# EAGLE design sliit 2019_V3 (EAGLE 9.5.0)

## Sheet 1 of 6
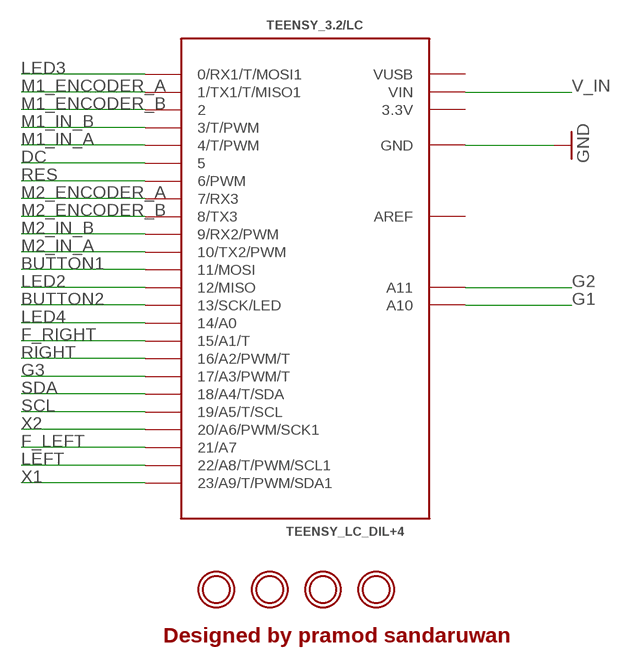
[diagram p0: schematic, sheet 1]

### Parts
TEENSY_3.2/LC  TEENSY_LC_DIL+4  [TEENSY3-DIL+4]
U$7  MOUNTINGHOLE2.5  [MOUNTINGHOLE_2.5_PLATED]
U$10  MOUNTINGHOLE2.5  [MOUNTINGHOLE_2.5_PLATED]
U$11  MOUNTINGHOLE2.5  [MOUNTINGHOLE_2.5_PLATED]
U$12  MOUNTINGHOLE2.5  [MOUNTINGHOLE_2.5_PLATED]

### Nets
BUTTON1: TEENSY_3.2/LC.11(11/MOSI) ; also sheet 5
BUTTON2: TEENSY_3.2/LC.13(13/SCK/LED) ; also sheet 5
DC: TEENSY_3.2/LC.5 ; also sheet 6
F_LEFT: TEENSY_3.2/LC.21/A7 ; also sheet 3
F_RIGHT: TEENSY_3.2/LC.15/A1(15/A1/T) ; also sheet 3
G1: TEENSY_3.2/LC.A10 ; also sheet 3
G2: TEENSY_3.2/LC.A11 ; also sheet 3
G3: TEENSY_3.2/LC.17/A3(17/A3/PWM/T) ; also sheet 3
GND: TEENSY_3.2/LC.AGND(GND) TEENSY_3.2/LC.GND ; also sheet 2,3,4,5,6
LED2: TEENSY_3.2/LC.12(12/MISO) ; also sheet 5
LED3: TEENSY_3.2/LC.0(0/RX1/T/MOSI1) ; also sheet 3,5
LED4: TEENSY_3.2/LC.14/A0 ; also sheet 5
LEFT: TEENSY_3.2/LC.22/A8(22/A8/T/PWM/SCL1) ; also sheet 3
M1_ENCODER_A: TEENSY_3.2/LC.1(1/TX1/T/MISO1) ; also sheet 4
M1_ENCODER_B: TEENSY_3.2/LC.2 ; also sheet 4
M1_IN_A: TEENSY_3.2/LC.4(4/T/PWM) ; also sheet 4
M1_IN_B: TEENSY_3.2/LC.3(3/T/PWM) ; also sheet 4
M2_ENCODER_A: TEENSY_3.2/LC.7(7/RX3) ; also sheet 4
M2_ENCODER_B: TEENSY_3.2/LC.8(8/TX3) ; also sheet 4
M2_IN_A: TEENSY_3.2/LC.10(10/TX2/PWM) ; also sheet 4
M2_IN_B: TEENSY_3.2/LC.9(9/RX2/PWM) ; also sheet 4
RES: TEENSY_3.2/LC.6(6/PWM) ; also sheet 6
RIGHT: TEENSY_3.2/LC.16/A2(16/A2/PWM/T) ; also sheet 3
SCL: TEENSY_3.2/LC.19/A5(19/A5/T/SCL) ; also sheet 3,6
SDA: TEENSY_3.2/LC.18/A4(18/A4/T/SDA) ; also sheet 3,6
V_IN: TEENSY_3.2/LC.VIN ; also sheet 2,4
X1: TEENSY_3.2/LC.23/A9(23/A9/T/PWM/SDA1) ; also sheet 3
X2: TEENSY_3.2/LC.20/A6(20/A6/PWM/SCK1) ; also sheet 3

### Notes on the sheet
- Designed by pramod sandaruwan

## Sheet 2 of 6: power
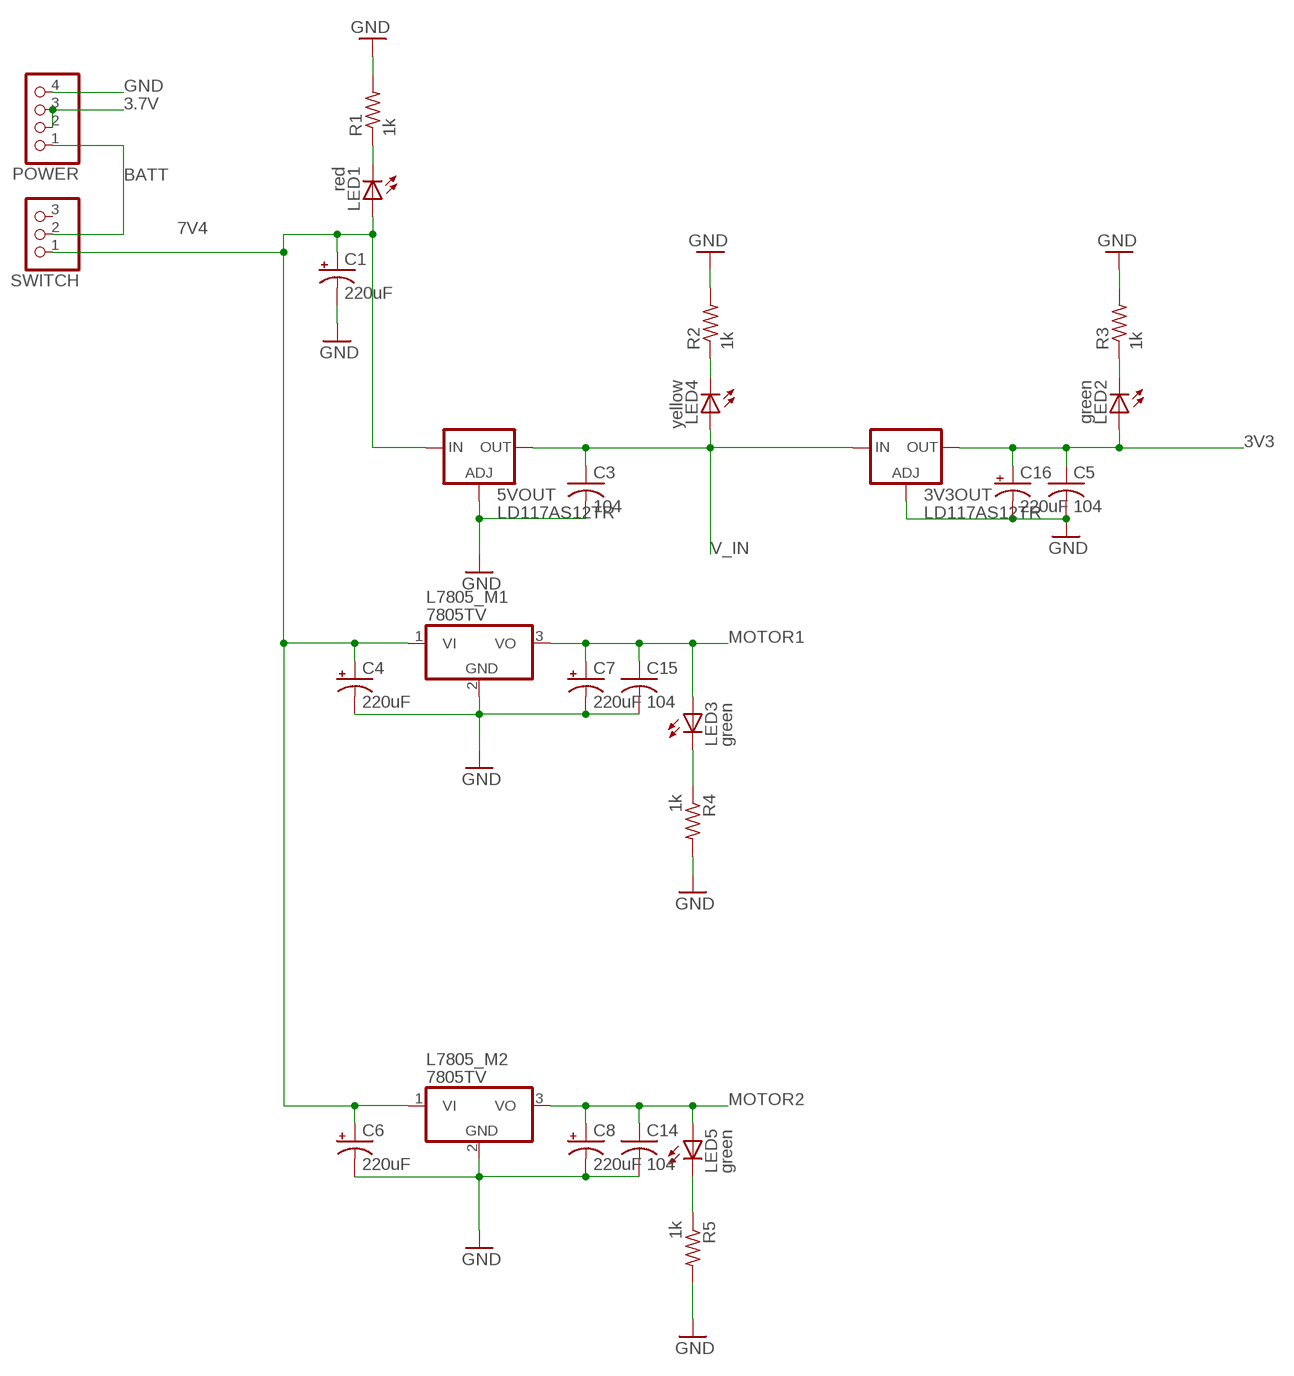
[diagram p1: schematic, sheet 2]

### Parts
3V3OUT  LD117AS12TR  [SOT223]
5VOUT  LD117AS12TR  [SOT223]
C1  220uF  CPOL-US153CLV-0505  [153CLV-0505]
C3  104  C-USC1206  [C1206]
C4  220uF  CPOL-US153CLV-0505  [153CLV-0505]
C5  104  C-USC1206  [C1206]
C6  220uF  CPOL-US153CLV-0505  [153CLV-0505]
C7  220uF  CPOL-US153CLV-0505  [153CLV-0505]
C8  220uF  CPOL-US153CLV-0505  [153CLV-0505]
C14  104  C-USC1206  [C1206]
C15  104  C-USC1206  [C1206]
C16  220uF  CPOL-US153CLV-0505  [153CLV-0505]
L7805_M1  7805TV  [TO220V]
L7805_M2  7805TV  [TO220V]
LED1  red  LEDSMT1206  [1206]
LED2  green  LEDSMT1206  [1206]
LED3  green  LEDSMT1206  [1206]
LED4  yellow  LEDSMT1206  [1206]
LED5  green  LEDSMT1206  [1206]
POWER  PINHD-1X4  [1X04]
R1  1k  R-US_R1206  [R1206]
R2  1k  R-US_R1206  [R1206]
R3  1k  R-US_R1206  [R1206]
R4  1k  R-US_R1206  [R1206]
R5  1k  R-US_R1206  [R1206]
SWITCH  PINHD-1X3  [1X03]

### Nets
3.7V: POWER.2 POWER.3
3V3: 3V3OUT.4(OUT) C5.1 C16.+ LED2.A ; also sheet 3,4,5,6
7V4: 5VOUT.3(IN) C1.+ C4.+ C6.+ L7805_M1.1(VI) L7805_M2.1(VI) LED1.A SWITCH.1
BATT: POWER.1 SWITCH.2
GND: 3V3OUT.1(ADJ) 5VOUT.1(ADJ) C1.- C3.2 C4.- C5.2 C6.- C7.- C8.- C14.2 C15.2 C16.- L7805_M1.2(GND) L7805_M2.2(GND) POWER.4 R1.2 R2.2 R3.2 R4.2 R5.2 ; also sheet 1,3,4,5,6
MOTOR1: C7.+ C15.1 L7805_M1.3(VO) LED3.A ; also sheet 4
MOTOR2: C8.+ C14.1 L7805_M2.3(VO) LED5.A ; also sheet 4
N$1: LED3.C R4.1
N$5: LED1.C R1.1
N$6: LED5.C R5.1
N$8: LED4.C R2.1
N$9: LED2.C R3.1
V_IN: 3V3OUT.3(IN) 5VOUT.4(OUT) C3.1 LED4.A ; also sheet 1,4
Unconnected: SWITCH.3

## Sheet 3 of 6: IR
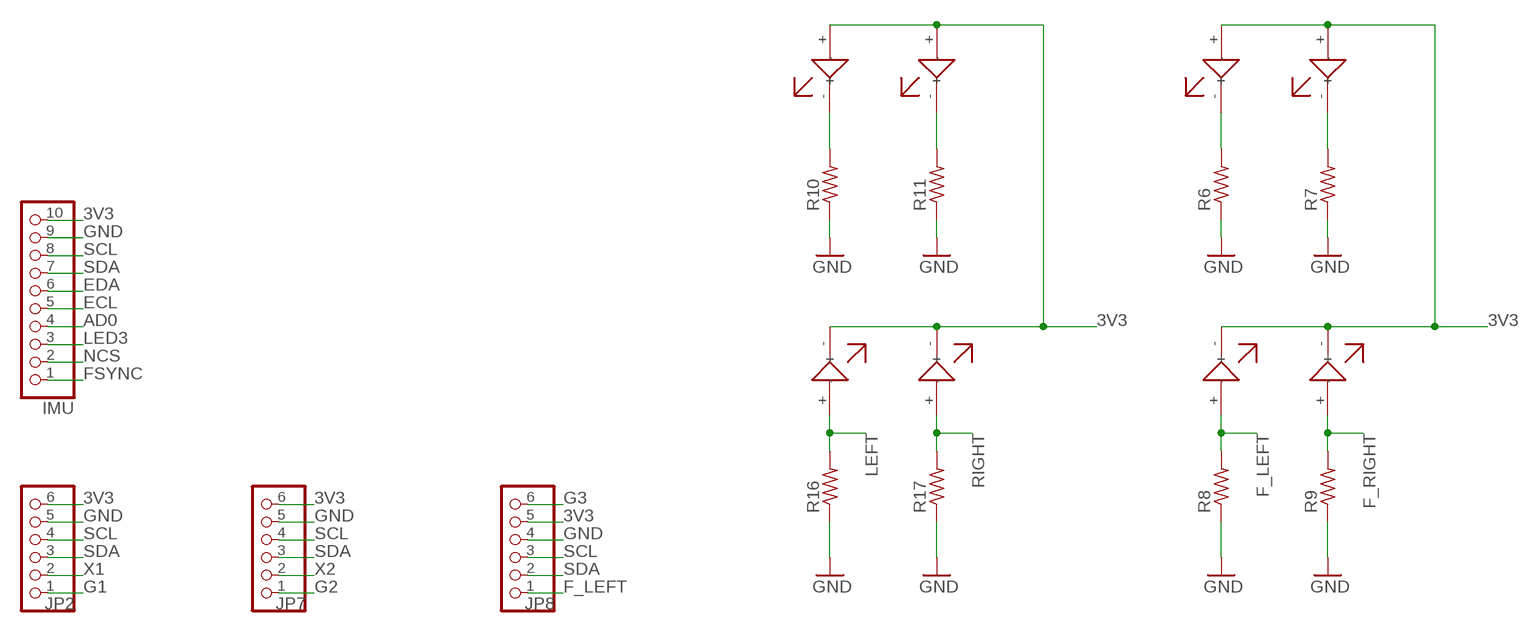
[diagram p2: schematic, sheet 3]

### Parts
IMU  PINHD-1X10  [1X10]
JP2  PINHD-1X6  [1X06]
JP7  PINHD-1X6  [1X06]
JP8  PINHD-1X6  [1X06]
R6  R-US_R0805  [R0805]
R7  R-US_R0805  [R0805]
R8  R-US_R0805  [R0805]
R9  R-US_R0805  [R0805]
R10  R-US_R0805  [R0805]
R11  R-US_R0805  [R0805]
R16  R-US_R0805  [R0805]
R17  R-US_R0805  [R0805]
U$1  IR  [IR]
U$4  IR  [IR]
U$5  IR  [IR]
U$6  IR  [IR]
U$8  IR  [IR]
U$9  IR  [IR]
U$14  IR  [IR]
U$15  IR  [IR]

### Nets
3V3: IMU.10 JP2.6 JP7.6 JP8.5 U$1.+ U$4.+ U$5.- U$6.- U$8.+ U$9.+ U$14.- U$15.- ; also sheet 2,4,5,6
AD0: IMU.4
ECL: IMU.5
EDA: IMU.6
F_LEFT: JP8.1 R8.2 U$5.+ ; also sheet 1
F_RIGHT: R9.2 U$6.+ ; also sheet 1
FSYNC: IMU.1
G1: JP2.1 ; also sheet 1
G2: JP7.1 ; also sheet 1
G3: JP8.6 ; also sheet 1
GND: IMU.9 JP2.5 JP7.5 JP8.4 R6.1 R7.1 R8.1 R9.1 R10.1 R11.1 R16.1 R17.1 ; also sheet 1,2,4,5,6
LED3: IMU.3 ; also sheet 1,5
LEFT: R16.2 U$14.+ ; also sheet 1
N$2: R7.2 U$4.-
N$3: R6.2 U$1.-
N$10: R11.2 U$9.-
N$11: R10.2 U$8.-
NCS: IMU.2
RIGHT: R17.2 U$15.+ ; also sheet 1
SCL: IMU.8 JP2.4 JP7.4 JP8.3 ; also sheet 1,6
SDA: IMU.7 JP2.3 JP7.3 JP8.2 ; also sheet 1,6
X1: JP2.2 ; also sheet 1
X2: JP7.2 ; also sheet 1

## Sheet 4 of 6: motors
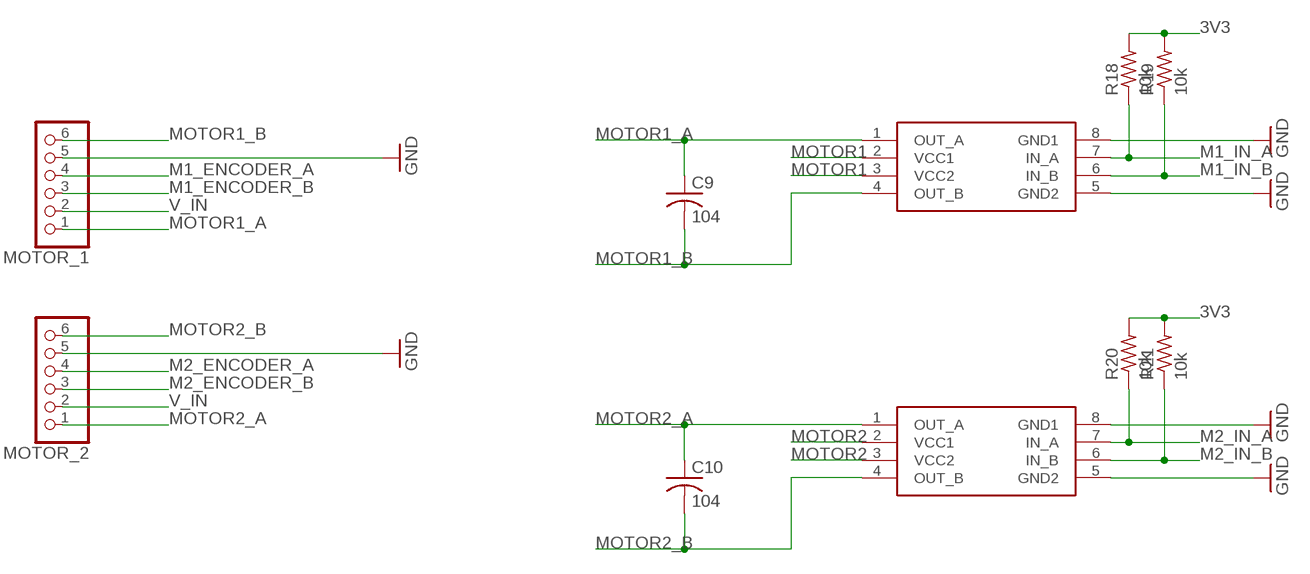
[diagram p3: schematic, sheet 4]

### Parts
C9  104  C-USC1206  [C1206]
C10  104  C-USC1206  [C1206]
MOTOR_1  PINHD-1X6  [1X06]
MOTOR_2  PINHD-1X6  [1X06]
R18  10k  R-US_R1206  [R1206]
R19  10k  R-US_R1206  [R1206]
R20  10k  R-US_R1206  [R1206]
R21  10k  R-US_R1206  [R1206]
U$2  L9110  [L9110]
U$3  L9110  [L9110]

### Nets
3V3: R18.2 R19.2 R20.2 R21.2 ; also sheet 2,3,5,6
GND: MOTOR_1.5 MOTOR_2.5 U$2.5(GND2) U$2.8(GND1) U$3.5(GND2) U$3.8(GND1) ; also sheet 1,2,3,5,6
M1_ENCODER_A: MOTOR_1.4 ; also sheet 1
M1_ENCODER_B: MOTOR_1.3 ; also sheet 1
M1_IN_A: R18.1 U$2.7(IN_A) ; also sheet 1
M1_IN_B: R19.1 U$2.6(IN_B) ; also sheet 1
M2_ENCODER_A: MOTOR_2.4 ; also sheet 1
M2_ENCODER_B: MOTOR_2.3 ; also sheet 1
M2_IN_A: R20.1 U$3.7(IN_A) ; also sheet 1
M2_IN_B: R21.1 U$3.6(IN_B) ; also sheet 1
MOTOR1: U$2.2(VCC1) U$2.3(VCC2) ; also sheet 2
MOTOR1_A: C9.1 MOTOR_1.1 U$2.1(OUT_A)
MOTOR1_B: C9.2 MOTOR_1.6 U$2.4(OUT_B)
MOTOR2: U$3.2(VCC1) U$3.3(VCC2) ; also sheet 2
MOTOR2_A: C10.1 MOTOR_2.1 U$3.1(OUT_A)
MOTOR2_B: C10.2 MOTOR_2.6 U$3.4(OUT_B)
V_IN: MOTOR_1.2 MOTOR_2.2 ; also sheet 1,2

## Sheet 5 of 6: Buttons & indicators
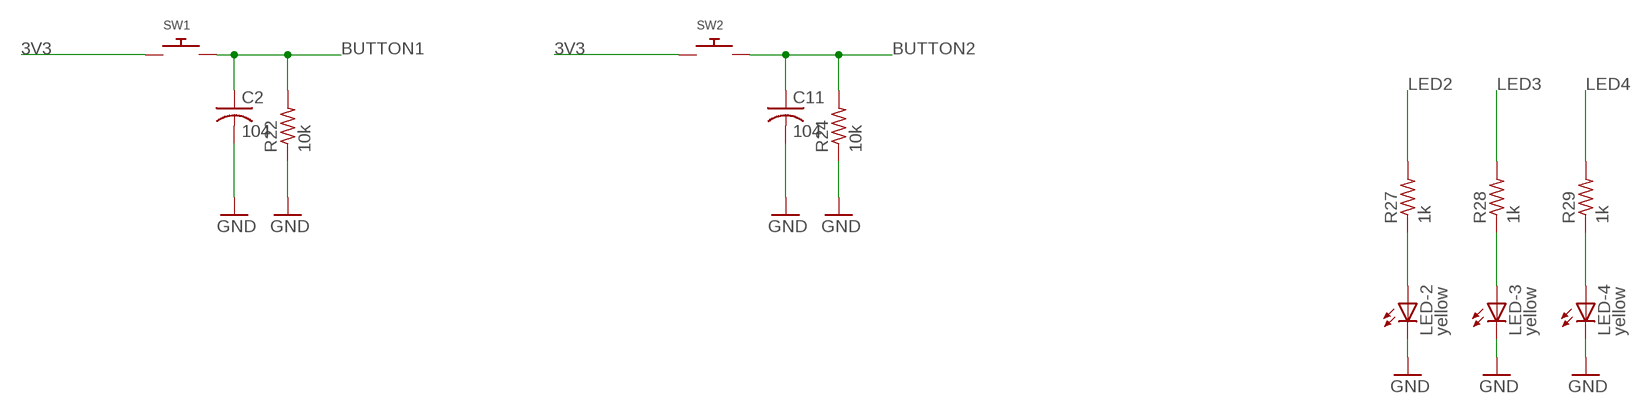
[diagram p4: schematic, sheet 5]

### Parts
C2  104  C-USC1206  [C1206]
C11  104  C-USC1206  [C1206]
LED-2  yellow  LEDSMT1206  [1206]
LED-3  yellow  LEDSMT1206  [1206]
LED-4  yellow  LEDSMT1206  [1206]
R22  10k  R-US_R1206  [R1206]
R24  10k  R-US_R1206  [R1206]
R27  1k  R-US_R1206  [R1206]
R28  1k  R-US_R1206  [R1206]
R29  1k  R-US_R1206  [R1206]
SW1  SWITCH_PUSHBUTTONC&K_KSS  [BTN_CK_KSS]
SW2  SWITCH_PUSHBUTTONC&K_KSS  [BTN_CK_KSS]

### Nets
3V3: SW1.P$1 SW2.P$1 ; also sheet 2,3,4,6
BUTTON1: C2.1 R22.2 SW1.P$2 ; also sheet 1
BUTTON2: C11.1 R24.2 SW2.P$2 ; also sheet 1
GND: C2.2 C11.2 LED-2.C LED-3.C LED-4.C R22.1 R24.1 ; also sheet 1,2,3,4,6
LED2: R27.2 ; also sheet 1
LED3: R28.2 ; also sheet 1,3
LED4: R29.2 ; also sheet 1
N$12: LED-2.A R27.1
N$13: LED-3.A R28.1
N$16: LED-4.A R29.1

## Sheet 6 of 6: Display
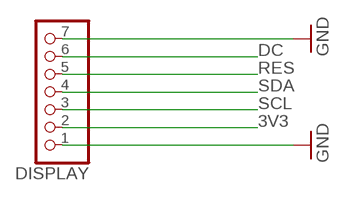
[diagram p5: schematic, sheet 6]

### Parts
DISPLAY  PINHD-1X7  [1X07]

### Nets
3V3: DISPLAY.2 ; also sheet 2,3,4,5
DC: DISPLAY.6 ; also sheet 1
GND: DISPLAY.1 DISPLAY.7 ; also sheet 1,2,3,4,5
RES: DISPLAY.5 ; also sheet 1
SCL: DISPLAY.3 ; also sheet 1,3
SDA: DISPLAY.4 ; also sheet 1,3

## Power pins joined to a net without a drawn wire
3.3V: TEENSY_3.2/LC.3.3V
AREF: TEENSY_3.2/LC.AREF
VUSB: TEENSY_3.2/LC.VUSB

## Library data of the parts
3V3OUT 5VOUT = v-reg:LD117A?*: Low drop fixed and adjustable positive voltage regulators 1 A Source: http://www.st.com/stonline/products/literature/ds/7194/ld1117axx.pdf
C1 C4 C6-C8 C16 = adafruit:CPOL-US: POLARIZED CAPACITOR, American symbol
C2 C9-C11 = resistor:C-US: CAPACITOR, American symbol
C3 C5 C14 C15 = rcl:C-US: CAPACITOR, American symbol; SPICEPREFIX: C
DISPLAY = pinhead:PINHD-1X7: PIN HEADER
IMU = pinhead:PINHD-1X10: PIN HEADER
JP2 JP7 JP8 MOTOR_1 MOTOR_2 = pinhead:PINHD-1X6: PIN HEADER
L7805_M1 L7805_M2 = linear:78*: Positive VOLTAGE REGULATOR Source: http://cache.national.com/ds/LM/LM78L05.pdf http://www.fairchildsemi.com/ds/LM/LM7805.pdf
LED1-LED5 LED-2-LED-4 = adafruit:LED: LED OSRAM: - CHIPLED LG R971, LG N971, LY N971, LG Q971, LY Q971, LO R971, LY R971 LH N974, LH R974 LS Q976, LO Q976, LY Q976 LO Q996 - Hyper CHIPLED LW Q18S LB Q993, LB Q99A, LB R99A - SideLED LS A670, LO A670, LY A670, LG A670, LP A670 LB A673, LV A673, LT A673, LW A673 LH A674 LY A675 LS A676, LA A676, LO A676, LY A676, LW A676 LS A679, LY A679, LG A679 - Hyper Micro SIDELED® LS Y876, LA Y876, LO Y876, LY Y876 LT Y87S - SmartLED LW L88C, LW L88S LB L89C, LB L89S, LG L890 LS L89K, LO L89K, LY L89K LS L896, LA L896, LO L896, LY L896 - TOPLED LS T670, LO T670, LY T670, LG T670, LP T670 LSG T670, LSP T670, LSY T670, LOP T670, LYG T670 LG T671, LOG T671, LSG T671 LB T673, LV T673, LT T673, LW T673 LH T674 LS T676, LA T676, LO T676, LY T676, LB T676, LH T676, LSB T676, LW T676 LB T67C, LV T67C, LT T67C, LS T67K, LO T67K, LY T67K, LW E67C LS E67B, LA E67B, LO E67B, LY E67B, LB E67C, LV E67C, LT E67C LW T67C LS T679, LY T679, LG T679 LS T770, LO T770, LY T770, LG T770, LP T770 LB T773, LV T773, LT T773, LW T773 LH T774 LS E675, LA E675, LY E675, LS T675 LS T776, LA T776, LO T776, LY T776, LB T776 LHGB T686 LT T68C, LB T68C - Hyper Mini TOPLED® LB M676 - Mini TOPLED Santana® LG M470 LS M47K, LO M47K, LY M47K Source: http://www.osram.convergy.de/
POWER = pinhead:PINHD-1X4: PIN HEADER
R1-R5 R18-R22 R24 R27-R29 = rcl:R-US_: RESISTOR, American symbol; SPICEPREFIX: R
R6-R11 R16 R17 = adafruit:R-US_: RESISTOR, American symbol
SW1 SW2 = adafruit:SWITCH_PUSHBUTTON: Buttons SOFTTOUCHSMD_SJ - Soft touch temporary push button (Super Junk Akihabara) Compatible with SKPMANE010 [Mouser: 688-SKPMAN] C&K_KSS = Digikey: KSS221GLFS
SWITCH = pinhead:PINHD-1X3: PIN HEADER
TEENSY_3.2/LC = Teensy_3_and_LC_Series_Boards_v1.1:TEENSY_LC_DIL+4: DIL package with 4 pins on the inside broken out.
U$1 U$4-U$6 U$8 U$9 U$14 U$15 = ir_diode:IR
U$2 U$3 = L9110:L9110
U$7 U$10-U$12 = microbuilder:MOUNTINGHOLE: Mounting Hole For #2 screws (0.086"/2.18mm width, 0.094"/2.4mm hole) use 2.5mm; BOM: EXCLUDE

## Board
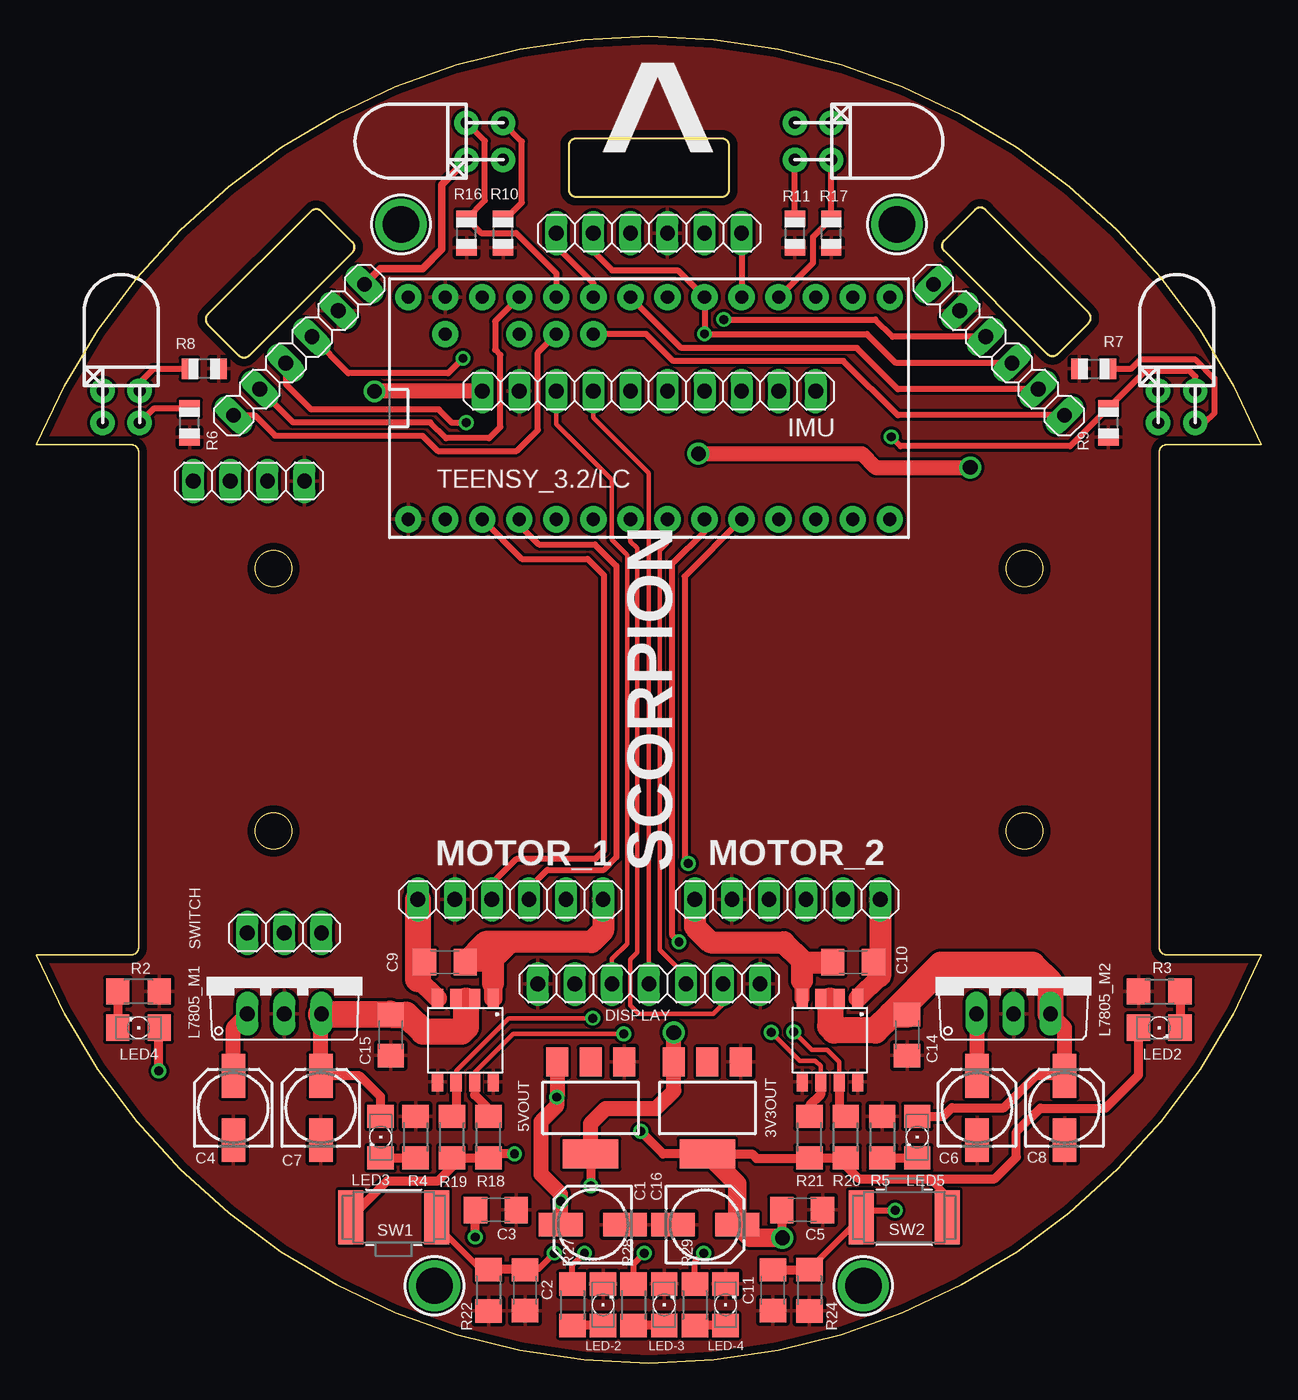
[diagram p6: board, top side]
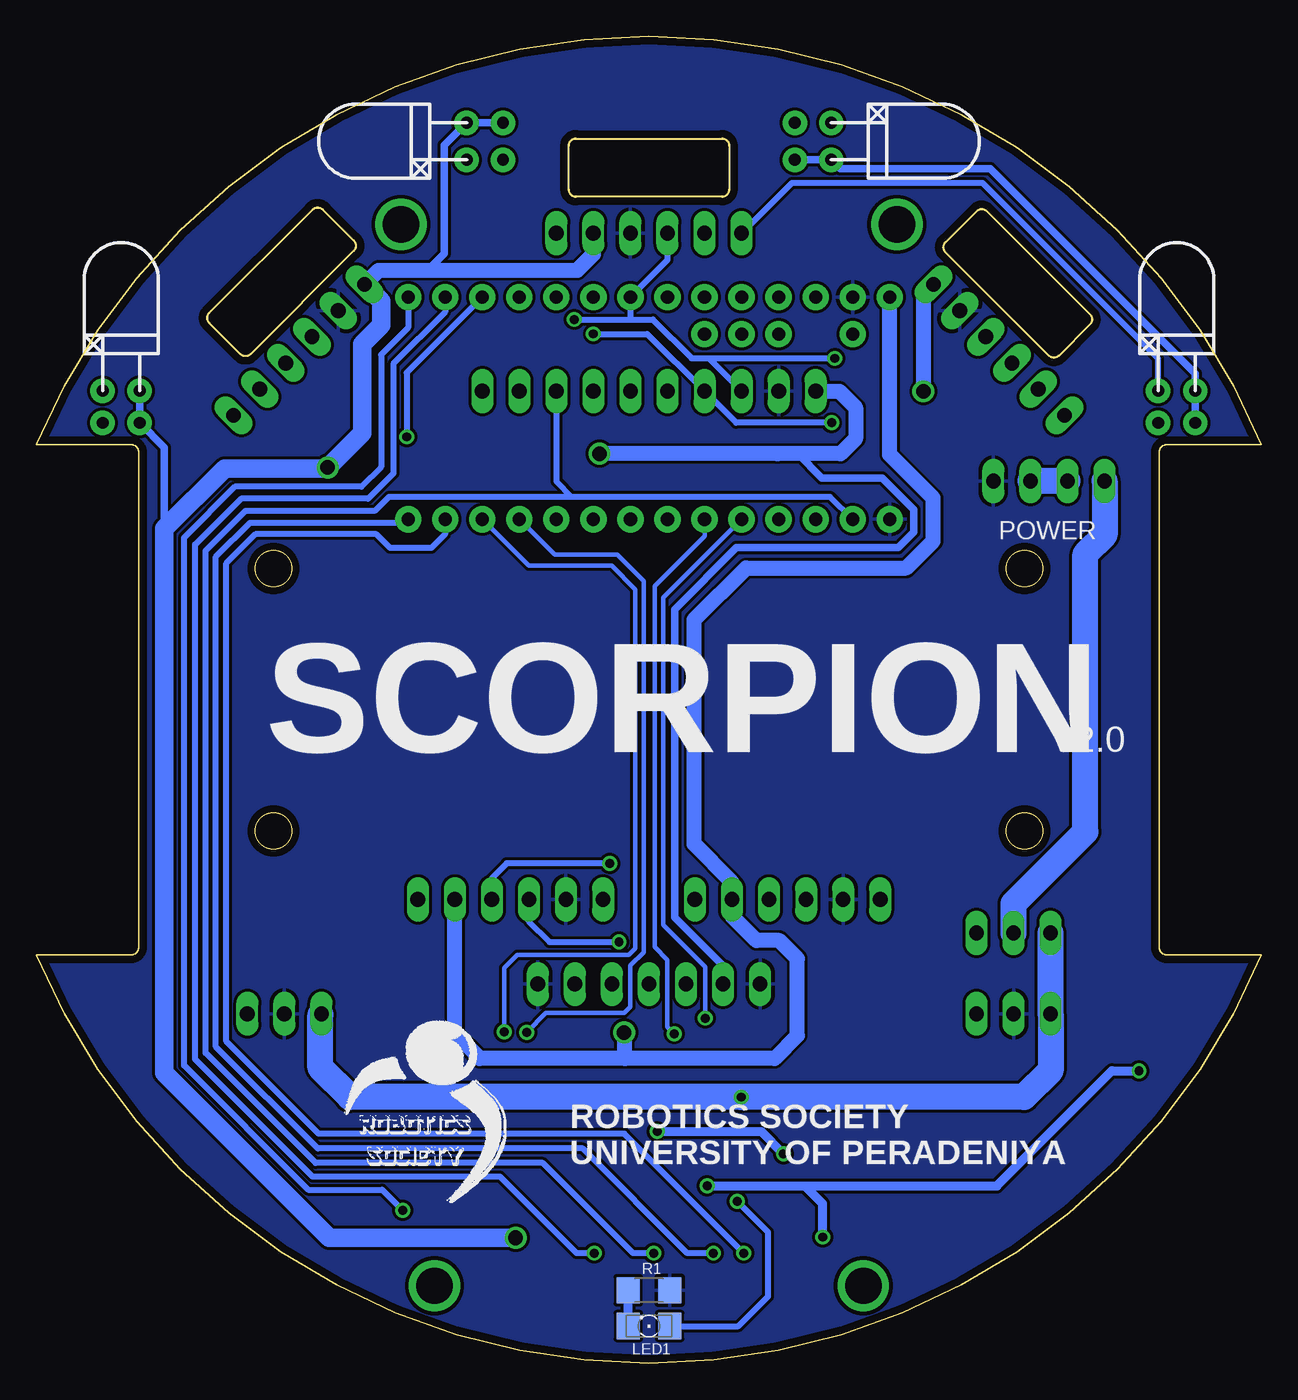
[diagram p7: board, bottom side, seen from below]

Size 84 x 91 mm. Coordinates in mm from the lower left corner, seen from the top.
Outline: 0,63 arc-135 84,63 77.5,63 arc90 77,62.5 77,28.5 arc90 77.5,28 84,28 arc-135 0,28 6.5,28 arc90 7,28.5 7,62.5 arc90 6.5,63 0,63
Outline: 47,84 37,84 arc90 36.5,83.5 36.5,80.5 arc90 37,80 47,80 arc90 47.5,80.5 47.5,83.5 arc90 47,84
Outline: 64.36,79.12 62.24,77 arc90 62.24,76.29 69.31,69.22 arc90 70.02,69.22 72.14,71.34 arc90 72.14,72.05 65.07,79.12 arc90 64.36,79.12
Outline: 11.76,71.23 13.88,69.11 arc90 14.59,69.11 21.66,76.18 arc90 21.66,76.89 19.54,79.01 arc90 18.83,79.01 11.76,71.94 arc90 11.76,71.23
Outline: circle at 67.75,54.5 radius 1.25
Outline: circle at 16.25,36.5 radius 1.25
Outline: circle at 16.25,54.5 radius 1.25
Outline: circle at 67.75,36.5 radius 1.25
Copper layers (1*16): Top 0.035mm / dielectric 1.5mm / Bottom 0.035mm
Design rules "default *": minimum track width 10mil, minimum drill 24mil, track to track 8mil, track to pad 8mil, pad to pad 8mil, via to via 8mil, smd to smd 8mil, copper to edge 20mil, drill to drill 8mil, minimum pad ring 10mil, minimum via ring 8mil, stop-mask expansion 4mil, vias tented up to drill 0mil, thermal gap 10mil

### Footprints (pad centres in the part's own frame; a part is rotated, then mirrored left to right if it is on the bottom)
SOT223 = smd 1.5 x 2: 1 -2.3,-3.15; 2 0,-3.15; 3 2.3,-3.15 | smd 3.8 x 2: 4 0,3.15
153CLV-0505 = smd 3 x 1.6: + 2.2,0; - -2.2,0
C1206 = smd 1.6 x 1.8: 1 -1.4,0; 2 1.4,0
1X07 = drill 1.016 long: 1 -7.62,0; 2 -5.08,0; 3 -2.54,0; 4 0,0; 5 2.54,0; 6 5.08,0; 7 7.62,0
1X10 = drill 1.016 long: 1 -11.43,0; 2 -8.89,0; 3 -6.35,0; 4 -3.81,0; 5 -1.27,0; 6 1.27,0; 7 3.81,0; 8 6.35,0; 9 8.89,0; 10 11.43,0
1X06 = drill 1.016 long: 1 -6.35,0; 2 -3.81,0; 3 -1.27,0; 4 1.27,0; 5 3.81,0; 6 6.35,0
TO220V = drill 1.016 long: 1 -2.54,-2.54; 2 0,-2.54; 3 2.54,-2.54
1206 = smd 1.6 x 1.803: A -1.422,0; C 1.422,0
1X04 = drill 1.016 long: 1 -3.81,0; 2 -1.27,0; 3 1.27,0; 4 3.81,0
R1206 = smd 1.6 x 1.803: 1 -1.422,0; 2 1.422,0
R0805 = smd 1.1 x 1.4: 1 -1,0; 2 1,0
BTN_CK_KSS = smd 1.7 x 3.7: P$1 -2.95,0; P$2 2.95,0
1X03 = drill 1.016 long: 1 -2.54,0; 2 0,0; 3 2.54,0
TEENSY3-DIL+4 = drill 0.9 pad 1.8: 0 -7.62,13.97; 1 -7.62,11.43; 2 -7.62,8.89; 3 -7.62,6.35; 3.3V 7.62,11.43; 4 -7.62,3.81; 5 -7.62,1.27; 6 -7.62,-1.27; 7 -7.62,-3.81; 8 -7.62,-6.35; 9 -7.62,-8.89; 10 -7.62,-11.43; 11 -7.62,-13.97; 12 -7.62,-16.51; 13 7.62,-16.51; 14/A0 7.62,-13.97; 15/A1 7.62,-11.43; 16/A2 7.62,-8.89; 17/A3 7.62,-6.35; 18/A4 7.62,-3.81; 19/A5 7.62,-1.27; 20/A6 7.62,1.27; 21/A7 7.62,3.81; 22/A8 7.62,6.35; 23/A9 7.62,8.89; A10 5.08,6.35; A11 5.08,3.81; AGND 7.62,13.97; AREF 5.08,8.89; GND -7.62,16.51; VIN 7.62,16.51; VUSB 5.08,13.97
IR = drill 0.8 pad 1.676: + -5.08,0; - -2.54,0
L9110 = smd 1.3 x 0.76: 1 0,3.81; 2 0,2.54; 3 0,1.27; 4 0,0; 5 5.715,0; 6 5.715,1.27; 7 5.715,2.54; 8 5.715,3.81
MOUNTINGHOLE_2.5_PLATED = drill 2.5 pad 3.2: P$1 0,0

### Placement (x,y rotation side)
3V3OUT  46,17.5 180 top
5VOUT  38,17.5 180 top
C1  38.15,9.5 180 top
C2  33.5,5 270 top
C3  31.5,10.5 0 top
C4  13.5,17.5 90 top
C5  52.5,10.5 0 top
C6  64.5,17.5 90 top
C7  19.5,17.5 90 top
C8  70.5,17.5 90 top
C9  28,27.5 180 top
C10  56,27.5 180 top
C11  50.5,5 270 top
C14  59.7,22.5 270 top
C15  24.3,22.5 270 top
C16  45.85,9.5 0 top
DISPLAY  42,26 0 top
IMU  42,66.66 180 top
JP2  18,69.5 45 top
JP7  66,69.5 135 top
JP8  42,77.5 0 top
L7805_M1  17,26.5 0 top
L7805_M2  67,26.5 0 top
LED1  42,2.54 180 bottom
LED2  77,23 0 top
LED3  23.6,15.5 270 top
LED4  7,23 180 top
LED5  60.4,15.5 270 top
LED-2  38.85,4 90 top
LED-3  43.05,4 90 top
LED-4  47.25,4 90 top
MOTOR_1  32.5,31.8 180 top
MOTOR_2  51.5,31.8 180 top
POWER  14.57,60.5 0 top
R1  42,4.99 0 bottom
R2  7,25.5 0 top
R3  77,25.5 180 top
R4  26,15.5 90 top
R5  58,15.5 90 top
R6  10.5,64.5 90 top
R7  72.5,68.2 0 top
R8  11.5,68.2 180 top
R9  73.5,64.5 90 top
R10  32,77.5 90 top
R11  52,77.5 90 top
R16  29.5,77.5 90 top
R17  54.5,77.5 90 top
R18  31,15.5 270 top
R19  28.5,15.5 270 top
R20  55.5,15.5 270 top
R21  53,15.5 270 top
R22  31,5 90 top
R24  53,5 90 top
R27  36.75,4 90 top
R28  40.95,4 90 top
R29  45.15,4 90 top
SW1  24.5,10 0 top
SW2  59.5,10 180 top
SWITCH  17,29.5 0 top
TEENSY_3.2/LC  42,65.5 90 top
U$1  9.62,64.5 0 top
U$2  27.5,25 270 top
U$3  52.5,25 270 top
U$4  82,64.5 0 top
U$5  2,66.7 0 bottom
U$6  74.38,66.7 0 bottom
U$7  25,78.1 0 top
U$8  32,87.62 90 top
U$9  52,80 270 top
U$10  59,78.1 0 top
U$11  27.3,5.3 0 top
U$12  56.7,5.3 0 top
U$14  29.5,80 270 bottom
U$15  54.5,87.62 90 bottom

### Tracks (layer width: path | path; a pad name or v marks a point on that pad's centre or on a via)
3.7V
  Bottom 1.778: POWER.2 POWER.3
3V3  (via drill 0.61, 1)
  Top 0.508: JP2.6 23.58,75.08 26.48,75.08 27.81,76.4 27.81,80.85 U$14.- | SW2.P$1 62.45,11.43 61.24,12.64
  Top 0.61: v41.44,15.88 42.98,14.35 3V3OUT.4 49.07,14.35 49.39,14.03 52.95,14.03 R21.2 R20.2 55.5,13.53 56.39,12.64 61.24,12.64 65.72,12.64 67.2,14.11 67.2,15.84 68.84,17.48 73.29,17.48 75.58,19.77 LED2.A | v32.78,14.36 31.28,14.36 R18.2 R19.2 28.5,13.44 27.56,12.5 24.05,12.5 SW1.P$1 | v51.14,8.59 51.14,10.46 C5.1
  Top 1.016: IMU.10 v23.18,66.66 | v64.03,61.44 57.53,61.44 56.59,62.38 v45.39,62.38
  Top 1.27: 3V3OUT.4 48.05,12.3 C16.+ 48.96,8.59 v51.14,8.59
  Bottom 0.508: DISPLAY.2 36.92,27.23 40.25,30.56 40.25,51.7 36.01,55.94 24.91,55.94 23.85,56.99 23.85,58.56 26.02,60.72 30.14,60.72 31.8,62.38 33.18,62.38 | U$8.+ U$14.- 28.88,81.92 18.6,81.92 4.54,67.86 U$5.- U$1.+ | U$6.- U$4.+ 75.22,62.8 75.22,57.23 | U$9.+ U$15.- 56.05,83.53 56.05,76.09 57.17,74.96
  Bottom 0.61: v41.44,15.88 34.3,15.88 v32.78,14.36
  Bottom 1.016: JP8.5 45.81,76.06 46.91,74.96 57.17,74.96 60.54,74.96 JP7.6 | IMU.10 28.95,66.66 27.83,65.54 27.83,63.41 28.86,62.38 33.18,62.38 v45.39,62.38 | JP2.6 23.18,73.3 v23.18,66.66
  Bottom 1.27: JP7.6 60.37,72.85 60.37,71.2 61.67,69.89 61.67,63.79 v64.03,61.44 64.1,61.36 71.09,61.36 75.22,57.23 75.22,19.9 63.92,8.59 v51.14,8.59
7V4  (via drill 0.61)
  Top 1.016: C1.+ v35.95,11.1 35.95,11.6 34.61,12.94 34.61,16.57 35.67,17.64 v35.67,18.25 35.7,18.27 5VOUT.3 | C4.+ 13.5,23 L7805_M1.1 | C6.+ 64.5,23.92 L7805_M2.1
  Bottom 0.406: LED1.A 35.87,2.54 33.85,4.55 33.85,9 v35.95,11.1
  Bottom 1.016: 64.53,23.89 L7805_M2.1
  Bottom 1.778: 64.53,23.89 64.53,20.25 62.52,18.25 v35.67,18.25 16.27,18.25 14.46,20.06 L7805_M1.1 SWITCH.1
BATT
  Bottom 1.778: SWITCH.2 17,31.53 12.08,36.44 12.08,55.48 10.76,56.81 POWER.1
BUTTON1  (via drill 0.61)
  Top 0.406: v35.5,7.54 34.36,6.4 C2.1 | SW1.P$2 27.45,9.45 30.48,6.42 R22.2
  Top 0.61: R22.2 33.48,6.42 C2.1
  Bottom 0.406: v35.5,7.54 43.69,15.73 64.66,15.73 70.98,22.06 70.98,54.86 68.99,56.85 60.69,56.85 59.76,55.92 56.92,55.92 55.97,56.86 TEENSY_3.2/LC.11
BUTTON2  (via drill 0.61)
  Top 0.406: v58.88,10.48 57.03,10.48 SW2.P$2 52.98,6.43 52.98,6.4
  Top 0.61: C11.1 52.98,6.4 R24.2
  Bottom 0.406: v58.88,10.48 60.29,11.9 65.37,11.9 73.88,20.4 73.88,56.62 70.39,60.11 61.73,60.11 60.36,61.47 60.36,69.16 58.51,71.01 TEENSY_3.2/LC.13
DC
  Top 0.305: TEENSY_3.2/LC.5 40.73,56.36 41.19,55.9 41.19,28.18 40.7,27.69 40.7,24.54 41.28,23.96 46.41,23.96 47.08,24.64 DISPLAY.6
F_LEFT
  Top 0.406: U$5.+ 7.08,67.24 8.04,68.2 R8.2 | JP8.1 35.65,76.6 38.19,74.06 TEENSY_3.2/LC.21/A7
  Bottom 0.406: JP8.1 32.19,80.96 19.13,80.96 7.08,68.91 U$5.+
F_RIGHT  (via drill 0.61)
  Top 0.406: U$6.+ 79.46,67.68 79.06,68.08 76.08,68.08 R9.2 70.89,62.89 59.26,62.89 v58.61,63.53
  Bottom 0.406: TEENSY_3.2/LC.15/A1 58.61,67.94 v58.61,63.53
G1
  Top 0.406: TEENSY_3.2/LC.A10 34.38,69.31 34.38,64.01 32.93,62.56 27.52,62.56 26.46,63.61 16.36,63.61 14.96,65.01 JP2.1
G2
  Top 0.406: TEENSY_3.2/LC.A11 41.81,70.58 43.65,68.74 55.34,68.74 59.07,65.01 JP7.1
G3
  Top 0.406: JP8.6 TEENSY_3.2/LC.17/A3
GND
  pour Top: -4.74,-9.87 98.13,-9.87 98.13,44.48 98.13,101.13 51.14,101.13 -4.74,101.13
  pour Bottom: -4.74,-9.87 98.13,-9.87 98.13,44.48 98.13,101.13 51.14,101.13 -4.74,101.13
LED2  (via drill 0.61)
  Top 0.406: R27.2 36.75,6.71 v37.58,7.54
  Bottom 0.406: v37.58,7.54 39.36,7.54 46.53,14.71 64.71,14.71 71.69,21.7 71.69,55.31 69.35,57.65 58.74,57.65 TEENSY_3.2/LC.12
LED3  (via drill 0.61)
  Top 0.406: R28.2 40.95,6.82 v41.67,7.54
  Bottom 0.406: v41.67,7.54 43.09,7.54 49.28,13.72 64.86,13.72 72.4,21.27 72.4,55.72 69.67,58.45 60.81,58.45 59.84,59.42 47.28,59.42 | 47.28,59.42 29.57,59.42 TEENSY_3.2/LC.0 | IMU.3 48.35,60.49 47.28,59.42
LED4  (via drill 0.61)
  Top 0.406: R29.2 45.15,6.93 v45.76,7.54
  Bottom 0.406: v45.76,7.54 46.95,7.54 52.2,12.78 65.06,12.78 73.11,20.84 73.11,56.15 69.97,59.29 61.25,59.29 59.53,61.02 59.53,68.55 55.97,72.1 TEENSY_3.2/LC.14/A0
LEFT
  Top 0.406: U$14.+ 30.76,83.82 30.76,79.75 R16.2 30.49,77.51 32.9,77.51 35.65,74.76 TEENSY_3.2/LC.22/A8
M1_ENCODER_A
  Top 0.406: MOTOR_1.4 31.23,32.9 32.91,34.58 38.32,34.58 38.9,35.16 38.9,54.04 37.79,55.16 33.29,55.16 TEENSY_3.2/LC.1
M1_ENCODER_B
  Top 0.406: TEENSY_3.2/LC.2 33.11,57.49 34.45,56.15 38.3,56.15 39.77,54.68 39.77,34.7 38.9,33.84 35.04,33.84 33.77,32.57 MOTOR_1.3
M1_IN_A  (via drill 0.61)
  Top 0.305: U$2.7 30.04,19.93 32.7,22.59 v40.27,22.59
  Top 0.61: U$2.7 30.04,18.39 31,17.43 R18.1
  Bottom 0.305: v40.27,22.59 40.73,23.05 40.73,27.67 41.62,28.56 41.62,53.31 38.19,56.74 TEENSY_3.2/LC.4
M1_IN_B  (via drill 0.61)
  Top 0.305: U$2.6 28.77,20.05 32.37,23.66 v38.14,23.66
  Top 0.61: U$2.6 28.77,17.19 R19.1
  Bottom 0.305: v38.14,23.66 38.14,27.19 41.01,30.06 41.01,52.52 TEENSY_3.2/LC.3
M2_ENCODER_A  (via drill 0.61)
  Top 0.406: TEENSY_3.2/LC.7 45.81,57.03 43.58,54.8 43.58,29.37 v44.06,28.89
  Bottom 0.406: v44.06,28.89 48.81,28.89 50.23,30.31 MOTOR_2.4
M2_ENCODER_B  (via drill 0.61)
  Top 0.406: TEENSY_3.2/LC.8 44.44,53.97 44.44,34.53 v44.69,34.27
  Bottom 0.406: v44.69,34.27 51.75,34.27 52.77,33.26 MOTOR_2.3
M2_IN_A  (via drill 0.61)
  Top 0.305: U$3.7 55.04,20.67 54.22,21.5 53.15,21.5 v51.93,22.72
  Top 0.61: U$3.7 55.04,17.38 R20.1
  Bottom 0.305: v51.93,22.72 51.93,27.11 51.04,28 43.4,28 42.94,28.46 42.94,53.07 44.56,54.69 50.24,54.69 TEENSY_3.2/LC.10
M2_IN_B  (via drill 0.61)
  Top 0.305: U$3.6 53.77,20.37 53.41,20.73 52.34,20.73 v50.38,22.69
  Top 0.61: U$3.6 53.77,18.41 53,17.64 R21.1
  Bottom 0.305: v50.38,22.69 49.07,24 43.68,24 43.27,24.42 43.27,27.26 42.36,28.18 42.36,53.63 44.18,55.46 48.47,55.46 TEENSY_3.2/LC.9
MOTOR1
  Top 0.508: U$2.3 29.25,25 | U$2.2 29.89,24.85
  Top 0.61: LED3.A 23.6,18.27 22.17,19.7 C7.+
  Top 0.813: 29.25,25 29.4,24.85 29.45,24.85 29.89,24.85
  Top 1.016: C7.+ 19.5,23.92 L7805_M1.3
  Top 1.778: 29.45,24.85 29.45,23.05 29.15,22.74 26.51,22.74 25.35,23.9 C15.1 | L7805_M1.3 24.24,23.96 C15.1 | 19.5,23.92 19.52,23.9 C15.1
MOTOR1_A
  Top 1.27: U$2.1 31.31,26.07 31.31,27.19 | C9.1 31,27.5 31.31,27.19 | 31.31,27.19 31.31,27.57 32.63,28.89
  Top 1.524: MOTOR_1.1 38.85,29.67 38.06,28.89 32.63,28.89 30.79,28.89 C9.1 | 31.31,26.07 31.31,27.57
MOTOR1_B
  Top 0.406: C9.2 26.18,27.5 26.15,27.53
  Top 1.016: 26.15,26.35 26.15,27.49 C9.2
  Top 1.27: U$2.4 26.15,26.35
  Top 1.778: MOTOR_1.6 26.15,27.53 26.15,26.35
MOTOR2
  Top 0.508: U$3.3 54.3,25 U$3.2
  Top 0.61: LED5.A 62.18,16.92 62.77,17.51 66.33,17.51 68.52,19.7 C8.+
  Top 0.813: 54.3,25 54.42,24.87
  Top 1.016: C8.+ 70.5,23 L7805_M2.3
  Top 1.778: L7805_M2.3 69.54,26.06 68.29,27.31 62.27,27.31 | 62.27,27.31 59.7,24.74 C14.1 58.6,23.9 | 54.42,24.87 54.42,23.1 54.7,22.82 57.52,22.82 58.6,23.9 | 58.6,23.9 62.02,27.31 62.27,27.31
MOTOR2_A
  Top 1.016: 57.85,26.54 57.85,27.39 | 57.85,27.39 MOTOR_2.1 | C10.1 57.51,27.39 57.85,27.39
  Top 1.27: U$3.1 57.85,26.54
  Top 1.524: MOTOR_2.1 57.85,26.54
MOTOR2_B
  Top 1.016: U$3.4 52.5,26.22
  Top 1.524: MOTOR_2.6 45.15,29.93 46.22,28.86 51.25,28.86 52.5,27.61 | 52.5,27.61 52.61,27.5 C10.2 | 52.5,26.22 52.5,27.61
N$1
  Top 0.61: LED3.C R4.1
N$2
  Top 0.406: R7.2 75.06,68.2 75.68,68.82 79.48,68.82 80.77,67.53 80.77,65.17 80.09,64.5 U$4.-
N$3
  Top 0.406: U$1.- 8.08,65.5 R6.2
N$5
  Bottom 0.61: LED1.C R1.1
N$6
  Top 0.61: R5.1 LED5.C
N$8
  Top 0.61: R2.1 LED4.C
N$9
  Top 0.61: R3.1 LED2.C
N$10
  Top 0.406: R11.2 U$9.-
N$11
  Top 0.406: R10.2 32.18,78.5 33.29,79.61 33.29,83.79 U$8.-
N$12
  Top 0.61: LED-2.A R27.1
N$13
  Top 0.61: LED-3.A R28.1
N$16
  Top 0.61: LED-4.A R29.1
RES
  Top 0.305: DISPLAY.5 44.54,26.53 42.74,28.33 42.74,55.72 43.27,56.25 TEENSY_3.2/LC.6
RIGHT
  Top 0.406: TEENSY_3.2/LC.16/A2 53.25,75.48 53.25,77.25 R17.2 U$15.+
SCL  (via drill 0.61)
  Top 0.305: DISPLAY.3 39.46,27.72 40.5,28.76 40.5,55.43 39.46,56.47 39.46,60.59 35.65,64.4 IMU.8
  Top 0.406: v47.13,71.59 57.52,71.59 58.71,70.4 JP7.4 | v29.25,68.92 28.23,67.9 21.39,67.9 JP2.4
  Bottom 0.406: JP8.3 40.73,75.66 TEENSY_3.2/LC.19/A5 43.27,71.61 43.3,71.59 | v47.13,71.59 43.3,71.59 | 43.3,71.59 41.74,71.59 39.07,68.92 37.91,68.92 | IMU.8 37.91,68.92 | 37.91,68.92 v29.25,68.92
SDA  (via drill 0.61)
  Top 0.305: IMU.7 38.19,64.86 42,61.05 DISPLAY.4
  Top 0.406: JP8.2 38.19,76.25 39.48,74.96 43.97,74.96 TEENSY_3.2/LC.18/A4 v45.81,70.59 56.94,70.59 58.93,68.6 JP7.3 | v29.47,64.5 28.49,64.5 27.59,65.41 18.84,65.41 17.1,67.15 JP2.3
  Bottom 0.406: v45.81,70.59 42.12,70.59 IMU.7 36.03,64.5 v29.47,64.5
V_IN  (via drill 0.61, 1)
  Top 0.61: 5VOUT.4 38,12.16 v38.01,12.15 | v30.09,8.64 30.09,10.49 C3.1 | v8.4,20.05 8.4,22.97 LED4.A
  Top 1.016: 5VOUT.4 38,16.43 39.03,17.46 42.48,17.46 43.7,18.68 3V3OUT.3 v43.7,22.67
  Bottom 0.61: v8.4,20.05 10.25,20.05 18.15,12.15 31.31,12.15 | v38.01,12.15 31.31,12.15 | v30.09,8.64 30.09,10.93 31.31,12.15
  Bottom 1.016: MOTOR_2.2 55.31,22.59 53.61,20.89 43.65,20.89 | 43.65,20.89 33.39,20.89 31.81,22.46 31.81,27.74 33.06,28.99 34.63,28.99 36.31,30.67 MOTOR_1.2 36.31,33 38.9,35.59 38.9,50.99 35.34,54.54 24.35,54.54 22.52,56.37 22.52,59.34 25.49,62.31 TEENSY_3.2/LC.VIN | v43.7,22.67 43.7,20.94 43.65,20.89
X1
  Top 0.406: TEENSY_3.2/LC.23/A9 31.45,71.46 31.45,69.52 31.81,69.15 31.81,64.22 31.03,63.44 28.1,63.44 27.02,64.52 17.59,64.52 JP2.2
X2
  Top 0.406: TEENSY_3.2/LC.20/A6 44.22,69.63 56.25,69.63 59.07,66.81 JP7.2

### Text on the board
tNames: ^ | SCORPION
bNames: V2.0 | SCORPION | ROBOTICS SOCIETY / UNIVERSITY OF PERADENIYA